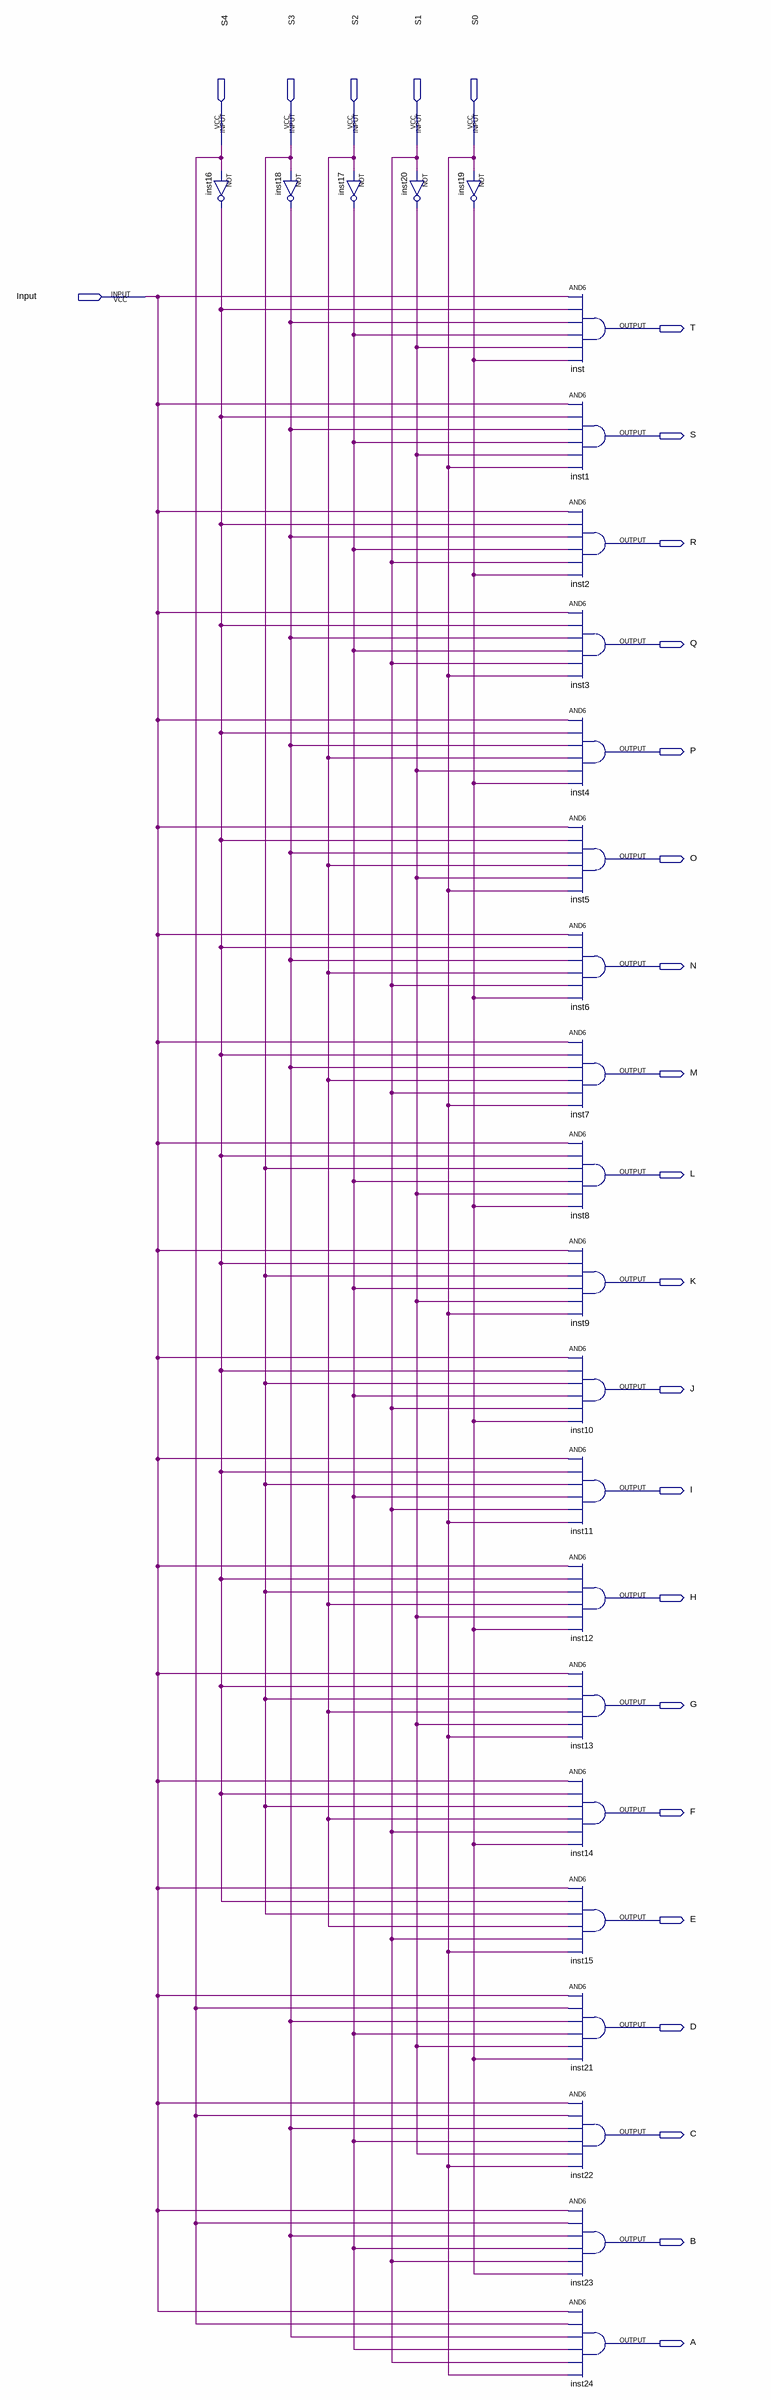
[diagram p0: schematic sheet]
// Quartus schematic Demux.bdf as structural Verilog: 25 symbols, 26 pins
module Demux (
  input  S4,
  input  S3,
  input  S2,
  input  S1,
  input  S0,
  input  Input,
  output T,
  output S,
  output R,
  output Q,
  output P,
  output O,
  output N,
  output M,
  output L,
  output K,
  output J,
  output I,
  output H,
  output G,
  output F,
  output E,
  output D,
  output C,
  output B,
  output A
);

  wire inst16_out, inst17_out, inst18_out, inst19_out, inst20_out;

  not inst16 (inst16_out, S4);
  not inst18 (inst18_out, S3);
  not inst17 (inst17_out, S2);
  not inst20 (inst20_out, S1);
  not inst19 (inst19_out, S0);
  and inst (T, Input, inst16_out, inst18_out, inst17_out, inst20_out, inst19_out);
  and inst1 (S, Input, inst16_out, inst18_out, inst17_out, inst20_out, S0);
  and inst2 (R, Input, inst16_out, inst18_out, inst17_out, S1, inst19_out);
  and inst3 (Q, Input, inst16_out, inst18_out, inst17_out, S1, S0);
  and inst4 (P, Input, inst16_out, inst18_out, S2, inst20_out, inst19_out);
  and inst5 (O, Input, inst16_out, inst18_out, S2, inst20_out, S0);
  and inst6 (N, Input, inst16_out, inst18_out, S2, S1, inst19_out);
  and inst7 (M, Input, inst16_out, inst18_out, S2, S1, S0);
  and inst8 (L, Input, inst16_out, S3, inst17_out, inst20_out, inst19_out);
  and inst9 (K, Input, inst16_out, S3, inst17_out, inst20_out, S0);
  and inst10 (J, Input, inst16_out, S3, inst17_out, S1, inst19_out);
  and inst11 (I, Input, inst16_out, S3, inst17_out, S1, S0);
  and inst12 (H, Input, inst16_out, S3, S2, inst20_out, inst19_out);
  and inst13 (G, Input, inst16_out, S3, S2, inst20_out, S0);
  and inst14 (F, Input, inst16_out, S3, S2, S1, inst19_out);
  and inst15 (E, Input, inst16_out, S3, S2, S1, S0);
  and inst21 (D, Input, S4, inst18_out, inst17_out, inst20_out, inst19_out);
  and inst22 (C, Input, S4, inst18_out, inst17_out, inst20_out, S0);
  and inst23 (B, Input, S4, inst18_out, inst17_out, S1, inst19_out);
  and inst24 (A, Input, S4, inst18_out, inst17_out, S1, S0);
endmodule
